# Altium schematic sheet DIn.SchDoc
size A4; SheetNumber: 5; SheetTotal: 6
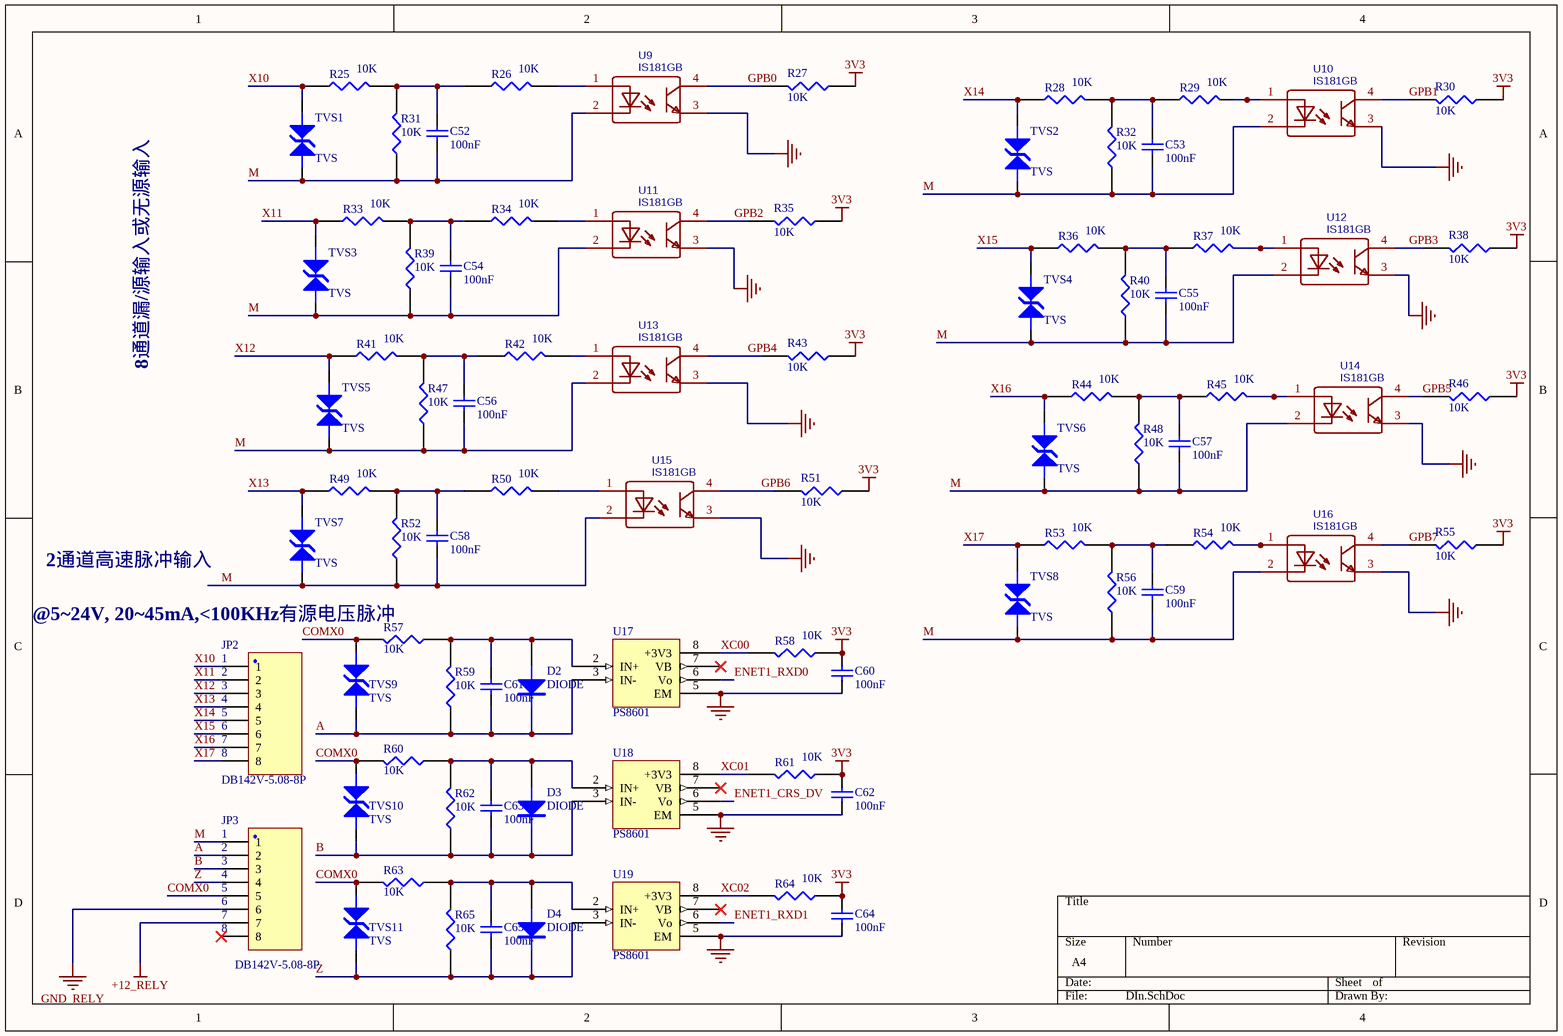
[diagram p0: DIn.SchDoc]

## Parts
C52  100nF  [0603C]
C53  100nF  [0603C]
C54  100nF  [0603C]
C55  100nF  [0603C]
C56  100nF  [0603C]
C57  100nF  [0603C]
C58  100nF  [0603C]
C59  100nF  [0603C]
C60  100nF  [0603C]
C61  100nF  [0603C]
C62  100nF  [0603C]
C63  100nF  [0603C]
C64  100nF  [0603C]
C65  100nF  [0603C]
D2  DIODE  [贴片二极管]
D3  DIODE  [贴片二极管]
D4  DIODE  [贴片二极管]
JP2  DB142V-5.08-8P  [DB142V-5.08-8P]
JP3  DB142V-5.08-8P  [DB142V-5.08-8P]
R25  10K  [0603]
R26  10K  [0603]
R27  10K  [0603]
R28  10K  [0603]
R29  10K  [0603]
R30  10K  [0603]
R31  10K  [0603]
R32  10K  [0603]
R33  10K  [0603]
R34  10K  [0603]
R35  10K  [0603]
R36  10K  [0603]
R37  10K  [0603]
R38  10K  [0603]
R39  10K  [0603]
R40  10K  [0603]
R41  10K  [0603]
R42  10K  [0603]
R43  10K  [0603]
R44  10K  [0603]
R45  10K  [0603]
R46  10K  [0603]
R47  10K  [0603]
R48  10K  [0603]
R49  10K  [0603]
R50  10K  [0603]
R51  10K  [0603]
R52  10K  [0603]
R53  10K  [0603]
R54  10K  [0603]
R55  10K  [0603]
R56  10K  [0603]
R57  10K  [0603]
R58  10K  [0603]
R59  10K  [0603]
R60  10K  [0603]
R61  10K  [0603]
R62  10K  [0603]
R63  10K  [0603]
R64  10K  [0603]
R65  10K  [0603]
TVS1  TVS  [TVS]
TVS2  TVS  [TVS]
TVS3  TVS  [TVS]
TVS4  TVS  [TVS]
TVS5  TVS  [TVS]
TVS6  TVS  [TVS]
TVS7  TVS  [TVS]
TVS8  TVS  [TVS]
TVS9  TVS  [TVS]
TVS10  TVS  [TVS]
TVS11  TVS  [TVS]
U9  IS181GB  [TLP181]
U10  IS181GB  [TLP181]
U11  IS181GB  [TLP181]
U12  IS181GB  [TLP181]
U13  IS181GB  [TLP181]
U14  IS181GB  [TLP181]
U15  IS181GB  [TLP181]
U16  IS181GB  [TLP181]
U17  PS8601  [SMD-8_6.3mm]
U18  PS8601  [SMD-8_6.3mm]
U19  PS8601  [SMD-8_6.3mm]

## Nets
3V3: C60.2 C62.2 C64.2 R27.1 R30.1 R35.1 R38.1 R43.1 R46.1 R51.1 R55.1 R58.1 R61.1 R64.1
+12_RELY: JP3.7
GND: C60.1 C62.1 C64.1 U9.3 U10.3 U11.3 U12.3 U13.3 U14.3 U15.3 U16.3 U17.5(EM) U18.5(EM) U19.5(EM)
GND_RELY: JP3.6
NC: U17.1(NC) U17.4(NC) U18.1(NC) U18.4(NC) U19.1(NC) U19.4(NC)
A: C61.1 D2.2(K) JP3.2 R59.1 TVS9.1(A) U17.3(IN-)
B: C63.1 D3.2(K) JP3.3 R62.1 TVS10.1(A) U18.3(IN-)
COMX0: JP3.5 R57.2 R60.2 R63.2 TVS9.2(K) TVS10.2(K) TVS11.2(K)
ENET1_CRS_DV: U18.6(Vo)
ENET1_RXD0: U17.6(Vo)
ENET1_RXD1: U19.6(Vo)
GPB0: R27.2 U9.4
GPB1: R30.2 U10.4
GPB2: R35.2 U11.4
GPB3: R38.2 U12.4
GPB4: R43.2 U13.4
GPB5: R46.2 U14.4
GPB6: R51.2 U15.4
GPB7: R55.2 U16.4
M: C52.2 C53.1 C54.1 C55.1 C56.1 C57.1 C58.1 C59.1 JP3.1 R31.1 R32.1 R39.1 R40.1 R47.1 R48.1 R52.1 R56.1 TVS1.1(A) TVS2.1(A) TVS3.1(A) TVS4.1(A) TVS5.1(A) TVS6.1(A) TVS7.1(A) TVS8.1(A) U9.2 U10.2 U11.2 U12.2 U13.2 U14.2 U15.2 U16.2
X10: JP2.1 R25.1 TVS1.2(K)
X11: JP2.2 R33.1 TVS3.2(K)
X12: JP2.3 R41.1 TVS5.2(K)
X13: JP2.4 R49.1 TVS7.2(K)
X14: JP2.5 R28.1 TVS2.2(K)
X15: JP2.6 R36.1 TVS4.2(K)
X16: JP2.7 R44.1 TVS6.2(K)
X17: JP2.8 R53.1 TVS8.2(K)
XC00: R58.2 U17.8(+3V3)
XC01: R61.2 U18.8(+3V3)
XC02: R64.2 U19.8(+3V3)
Z: C65.1 D4.2(K) JP3.4 R65.1 TVS11.1(A) U19.3(IN-)
NetC52_1: C52.1 R25.2 R26.1 R31.2
NetC53_2: C53.2 R28.2 R29.1 R32.2
NetC54_2: C54.2 R33.2 R34.1 R39.2
NetC55_2: C55.2 R36.2 R37.1 R40.2
NetC56_2: C56.2 R41.2 R42.1 R47.2
NetC57_2: C57.2 R44.2 R45.1 R48.2
NetC58_2: C58.2 R49.2 R50.1 R52.2
NetC59_2: C59.2 R53.2 R54.1 R56.2
NetC61_2: C61.2 D2.1(A) R57.1 R59.2 U17.2(IN+)
NetC63_2: C63.2 D3.1(A) R60.1 R62.2 U18.2(IN+)
NetC65_2: C65.2 D4.1(A) R63.1 R65.2 U19.2(IN+)
NetR26_2: R26.2 U9.1
NetR29_2: R29.2 U10.1
NetR34_2: R34.2 U11.1
NetR37_2: R37.2 U12.1
NetR42_2: R42.2 U13.1
NetR45_2: R45.2 U14.1
NetR50_2: R50.2 U15.1
NetR54_2: R54.2 U16.1

Not connected (* = marked no-connect by the designer): JP3 8*; U17 7(VB)*; U18 7(VB)*; U19 7(VB)*

## Notes on the sheet
- 8通道漏/源输入或无源输入
- 2通道高速脉冲输入
- @5~24V, 20~45mA,<100KHz有源电压脉冲

## Library data of the parts
C52-C65 = CAP: Capacitor; Value: 104; Published: 8-Jun-2000; LatestRevisionDate: 17-Jul-2002; LatestRevisionNote: Re-released for DXP Platform.; PackageReference: RAD-0.3; Publisher: Altium Limited
R25-R65 = RES1
U9-U16 = IS181GB: BOM_Manufacturer: ISOCOM; BOM_Supplier: LCSC; BOM_Manufacturer Part: IS181GB; BOM_Supplier Part: C84196; BOM_JLCPCB Part Class: Extended Part; spicePre: U; spiceSymbolName: IS181GB
U17-U19 = PS8601: High speed optocoupler